# EasyEDA schematic BatteryPowerModule_Relay.json
TITLE: Sheet_1; REV: 1.0; Date: 2026-08-14; Sheet: 1/1; Drawn By: Ananthapadmanaban gururajan; Company: Your Company
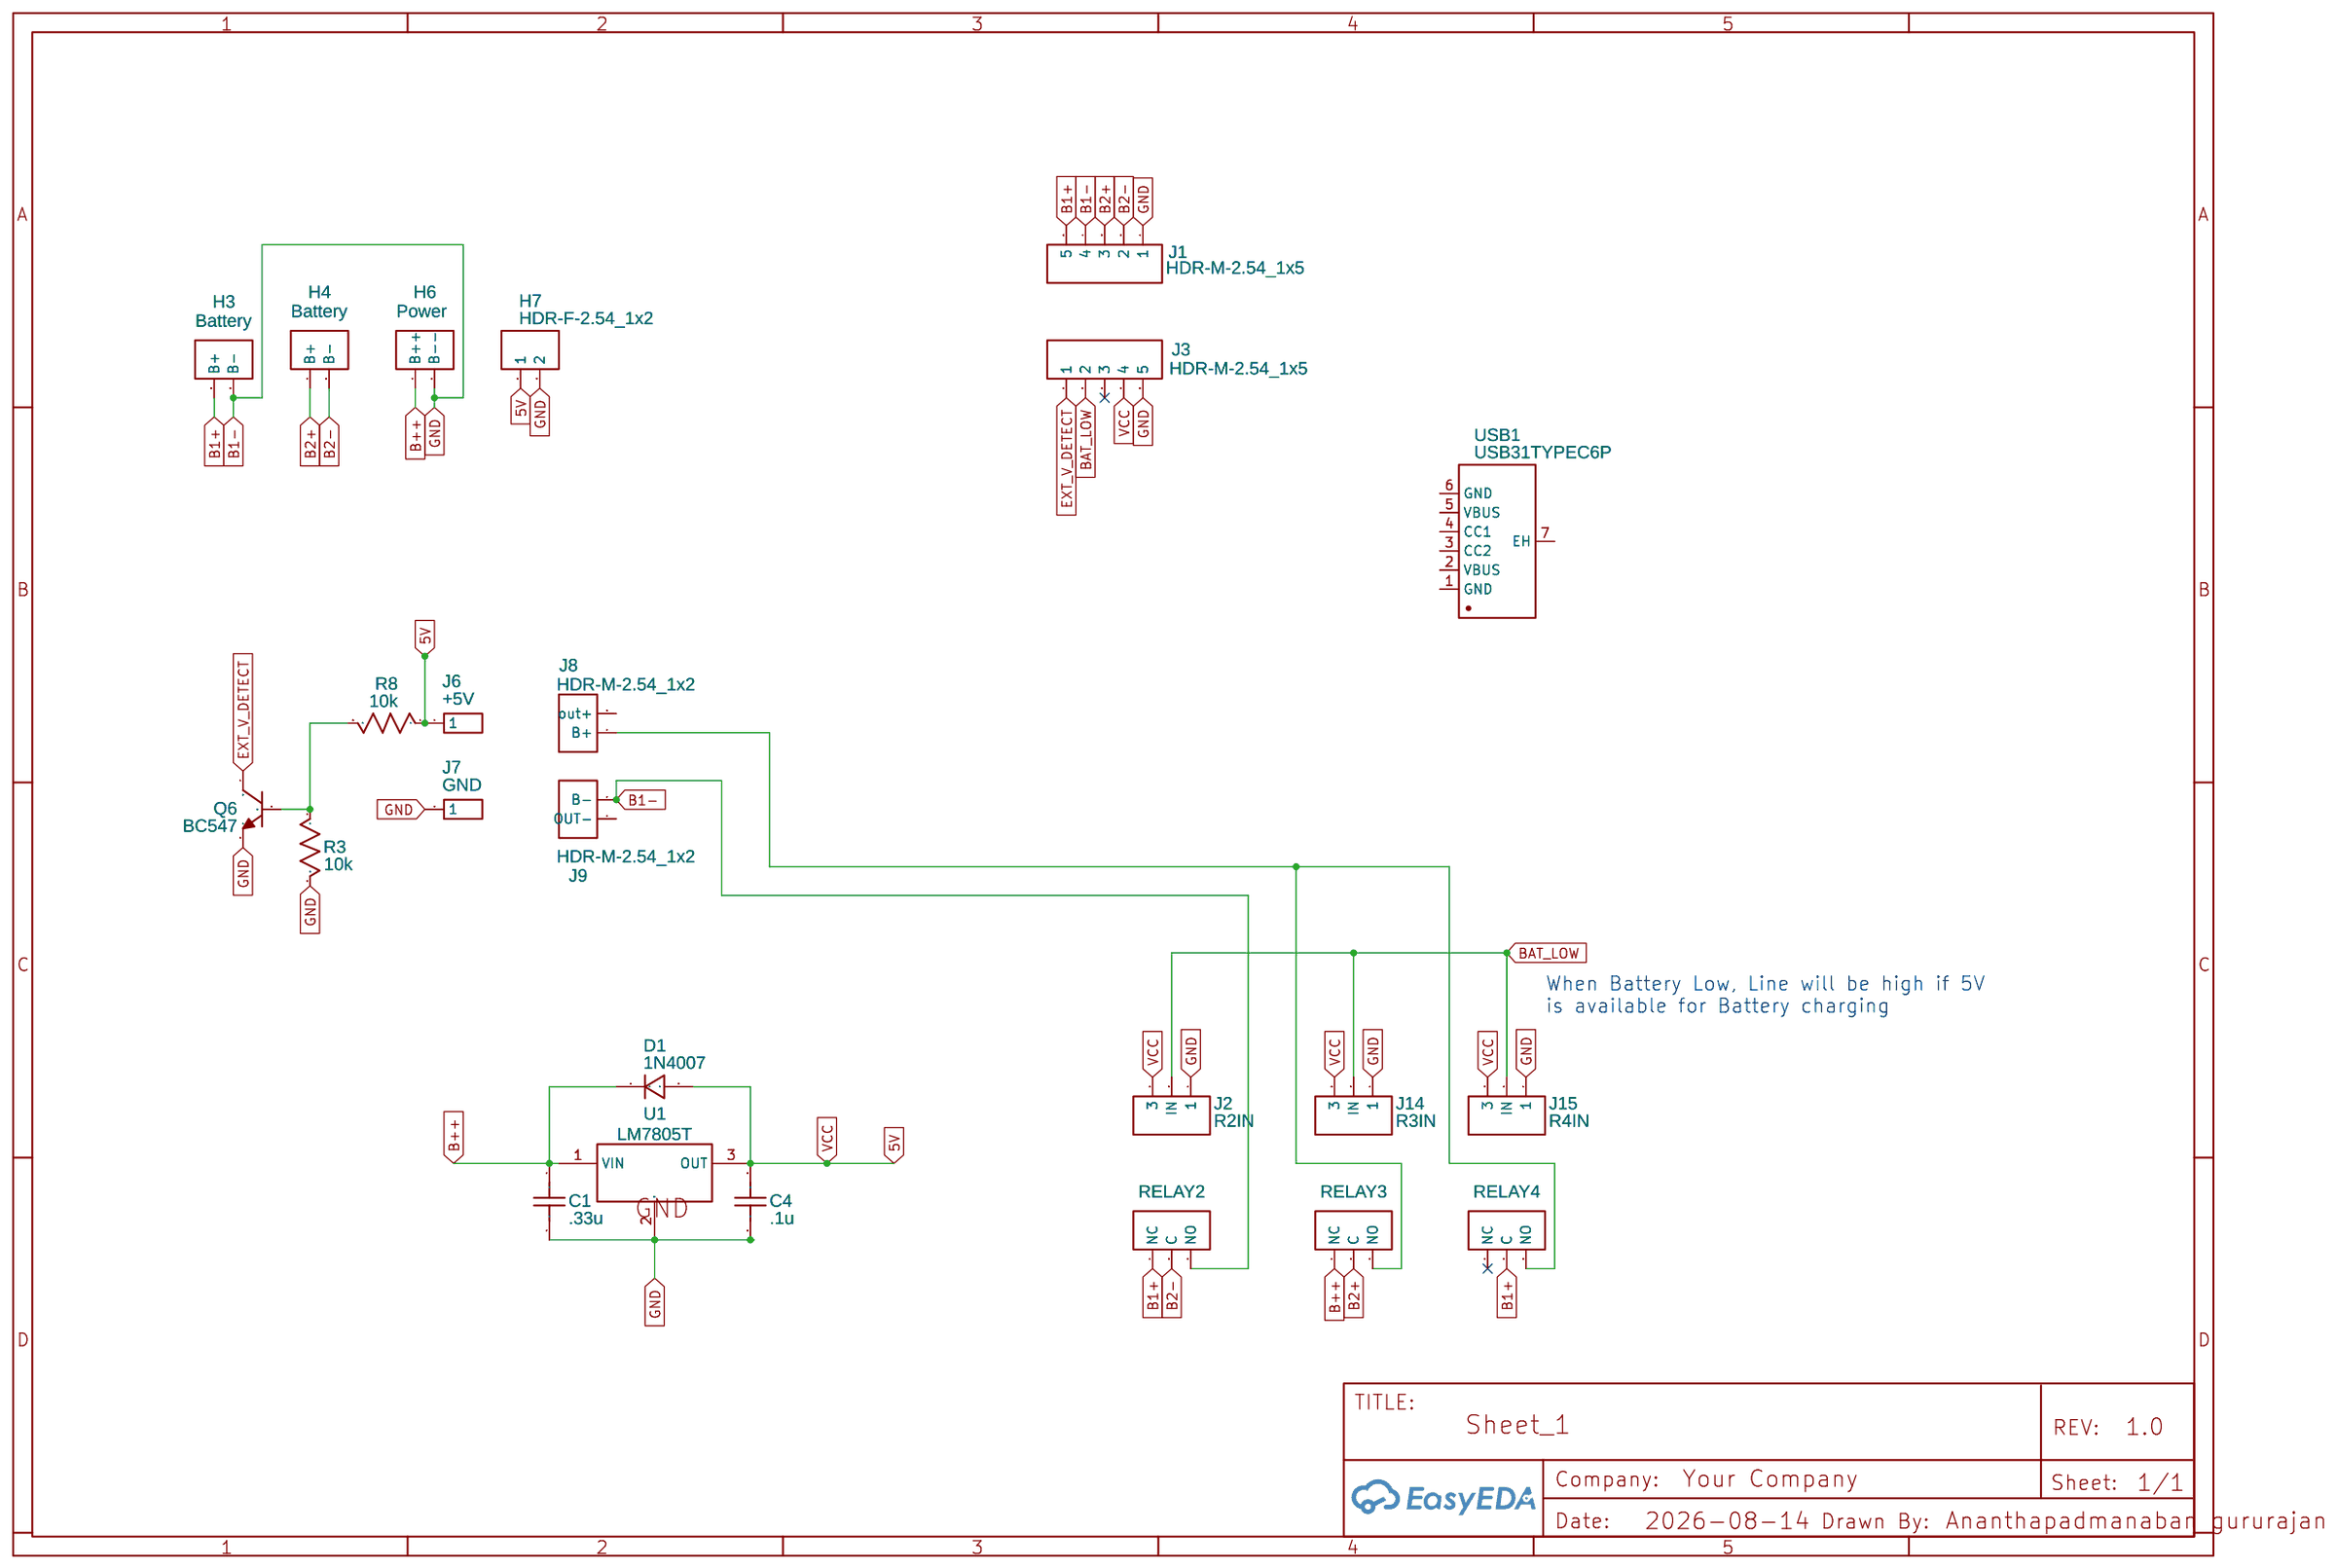
[diagram p0: schematic sheet]

## Parts
C1  .33u  [RAD-0.1]
C4  .1u  [RAD-0.1]
D1  1N4007  [DO-41_BD2.4-L4.7-P8.70-D0.9-RD]
H3  Battery  [HDR-F-2.54_1X2]
H4  Battery  [HDR-F-2.54_1X2]
H6  Power  [HDR-F-2.54_1X2]
H7  HDR-F-2.54_1x2  [HDR-F-2.54_1X2]
J1  HDR-M-2.54_1x5  [HDR-M-2.54_1X5]
J2  R2IN  [HDR-M-2.54_1X3]
J3  HDR-M-2.54_1x5  [HDR-M-2.54_1X5]
J6  +5V  [HDR-M-2.54_1X1]
J7  GND  [HDR-M-2.54_1X1]
J8  HDR-M-2.54_1x2  [HDR-M-2.54_1X2]
J9  HDR-M-2.54_1x2  [HDR-M-2.54_1X2]
J14  R3IN  [HDR-M-2.54_1X3]
J15  R4IN  [HDR-M-2.54_1X3]
Q6  BC547  [TO-92-3_L4.5-W3.5-P1.27-L]
R3  10k  [R_AXIAL-0.3]
R8  10k  [R_AXIAL-0.3]
RELAY2  Relay1  [HDR-M-2.54_1X3]
RELAY3  Relay1  [HDR-M-2.54_1X3]
RELAY4  Relay1  [HDR-M-2.54_1X3]
U1  LM7805T  [TO-220-3_L10.0-W4.5-P2.54-L]
USB1  USB31TYPEC6P  [USB-TYPE-C_TYPEC-6PIN-1]

## Library data of the parts
C1 C4 = C_RAD-0.1_US: Contributor: LCEDA_Lib
D1 = 1N4007: Supplier: LCSC; Manufacturer: SEMTECH; Supplier Part: C106903; Contributor: LCEDA_Lib
H3 H4 H6 H7 = HDR-F-2.54_1x2: Supplier Part: C49661; Supplier: LCSC; Contributor: LCEDA_Lib
J1 J3 = HDR-M-2.54_1x5: Supplier Part: C358687; Supplier: LCSC; Contributor: LCEDA_Lib
J2 J14 J15 RELAY2-RELAY4 = HDR-M-2.54_1x3: Supplier Part: C180248; Supplier: LCSC; Contributor: LCEDA_Lib
J6 J7 = HDR-M-2.54_1x1: Supplier Part: C81276; Supplier: LCSC; Contributor: LCEDA_Lib
J8 J9 = HDR-M-2.54_1x2: Supplier Part: C124375; Supplier: LCSC; Contributor: LCEDA_Lib
Q6 = BC547: Contributor: LCSC; Supplier: LCSC; Supplier Part: C2910381; Manufacturer: CJ(江苏长电/长晶); Manufacturer Part: BC547(RANGE:420-800); JLCPCB Part Class: Extended Part
R3 R8 = R_AXIAL-0.3_US: Contributor: LCEDA_Lib
U1 = LM7805T: Contributor: LCSC; Supplier: LCSC; Supplier Part: C507145; Manufacturer: HGC(华冠); JLCPCB Part Class: Extended Part
USB1 = USB31TYPEC6P: Supplier: LCSC; Supplier Part: C9900005241; Manufacturer: null; Contributor: lcsc; JLCPCB Part Class: Extended Part

## Nets
5V: C4.1 D1.2 H7.1 J2.3 J3.4 J6.1 J14.3 J15.3 R8.1 U1.3(OUT)
B1+: H3.1(B+) J1.5 RELAY2.1(NC) RELAY4.2(C)
B1-: C1.2 C4.2 H3.2(B-) H6.2(B--) H7.2 J1.1 J1.4 J2.1 J3.5 J7.1 J9.2(B-) J14.1 J15.1 Q6.3(E) R3.2 RELAY2.3(NO) U1.2(GND)
B2+: H4.1(B+) J1.3 RELAY3.2(C)
B2-: H4.2(B-) J1.2 RELAY2.2(C)
B++: C1.1 D1.1 H6.1(B++) RELAY3.1(NC) U1.1(VIN)
BAT_LOW: J2.2(IN) J3.2 J14.2(IN) J15.2(IN)
EXT_V_DETECT: J3.1 Q6.1(C)
Net-(J8-1): J8.1(B+) RELAY3.3(NO) RELAY4.3(NO)
Net-(Q6-2): Q6.2(B) R3.1 R8.2

Not connected (* = marked no-connect by the designer): J3 3*; J8 2(out+); J9 1(OUT-); RELAY4 1(NC)*; USB1 1(GND) 2(VBUS) 3(CC2) 4(CC1) 5(VBUS) 6(GND) 7(EH)

## Notes on the sheet
- When Battery Low, Line will be high if 5V
  is available for Battery charging
